# Altium schematic sheet EFM32PG22-40.SchDoc
size A4
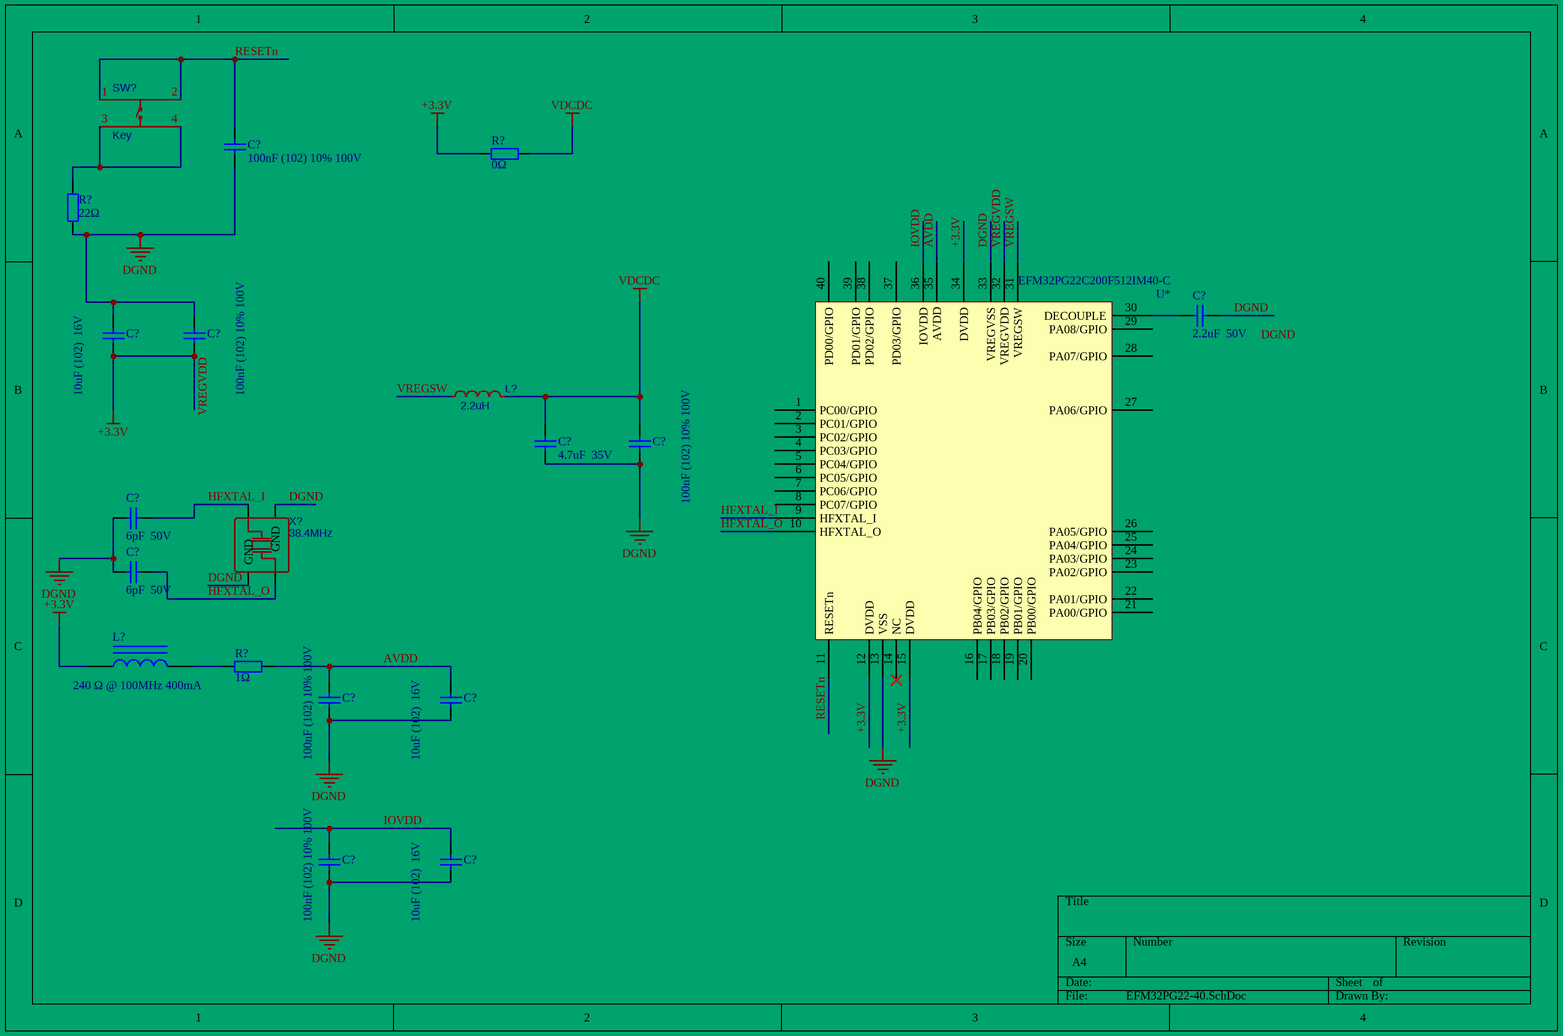
[diagram p0: EFM32PG22-40.SchDoc]

## Parts
(Parts that share a designator on the sheet are numbered #1, #2 ... from top to bottom, then left to right.)
C?#1  100nF (102) 10% 100V  [0805_C]
C?#2  2.2uF  50V  [0603_C]
C?#3  10uF (102)  16V  [0805_C]
C?#4  100nF (102) 10% 100V  [0805_C]
C?#5  4.7uF  35V  [0603_C]
C?#6  100nF (102) 10% 100V  [0805_C]
C?#7  6pF  50V  [0603_C]
C?#8  6pF  50V  [0603_C]
C?#9  100nF (102) 10% 100V  [0805_C]
C?#10  10uF (102)  16V  [0805_C]
C?#11  100nF (102) 10% 100V  [0805_C]
C?#12  10uF (102)  16V  [0805_C]
L?#1  2.2uH  [L1008]
L?#2  240 Ω @ 100MHz 400mA  [0603_L]
R?#1  0Ω  [0603_R]
R?#2  22Ω  [0603_R]
R?#3  1Ω  [0805_R]
SW?  Key  [SW-TH_4P-L6.0-W6.0-P4.50-LS6.5]
U*  EFM32PG22C200F512IM40-C  [QFN-40_L5.0-W5.0-P0.4-Hand]
X?  38.4MHz  [OSC-SMD_4P-L3.2-W2.5-BL]

## Nets
+3.3V: C?#3.1 C?#4.1 L?#2.1 R?#1.2 U*.12(DVDD) U*.15(DVDD) U*.32(VREGVDD) U*.34(DVDD)  [also labelled VREGVDD]
DGND: C?#1.1 C?#2.2 C?#3.2 C?#4.2 C?#5.1 C?#6.1 C?#7.1 C?#8.1 C?#9.1 C?#10.1 C?#11.1 C?#12.1 R?#2.1 U*.13(VSS) U*.33(VREGVSS) X?.2(GND) X?.4(GND)
VDCDC: C?#5.2 C?#6.2 L?#1.2 R?#1.1
AVDD: C?#9.2 C?#10.2 R?#3.2 U*.35(AVDD)
HFXTAL_I: C?#7.2 U*.9(HFXTAL_I) X?.3(OSC2)
HFXTAL_O: C?#8.2 U*.10(HFXTAL_O) X?.1(OSC1)
IOVDD: C?#11.2 C?#12.2 U*.36(IOVDD)
RESETn: C?#1.2 SW?.1(A) SW?.2(B) U*.11(RESETn)
VREGSW: L?#1.1 U*.31(VREGSW)
NetC?#2_1: C?#2.1 U*.30(DECOUPLE)
NetL?#2_2: L?#2.2 R?#3.1
NetR?#2_2: R?#2.2 SW?.3(C) SW?.4(D)

Not connected (* = marked no-connect by the designer): U* 1(PC00/GPIO) 2(PC01/GPIO) 3(PC02/GPIO) 4(PC03/GPIO) 5(PC04/GPIO) 6(PC05/GPIO) 7(PC06/GPIO) 8(PC07/GPIO) 14(NC)* 16(PB04/GPIO) 17(PB03/GPIO) 18(PB02/GPIO) 19(PB01/GPIO) 20(PB00/GPIO) 21(PA00/GPIO) 22(PA01/GPIO) 23(PA02/GPIO) 24(PA03/GPIO) 25(PA04/GPIO) 26(PA05/GPIO) 27(PA06/GPIO) 28(PA07/GPIO) 29(PA08/GPIO) 37(PD03/GPIO) 38(PD02/GPIO) 39(PD01/GPIO) 40(PD00/GPIO)

## Notes on the sheet
- Labels drawn without touching a wire or pin: DGND

## Library data of the parts
C?#1 C?#4 C?#6 C?#9 C?#11 = 0805 1nF (102) 10% 50V: TCC0805X7R104K101DTS; ComponentLink1Description: 供应商链接; ComponentLink1URL: http://www.szlcsc.com/product/details_52223.html; Package: 0805; Supplier: LC; SuppliersPartNumber: C51210
C?#2 = 0603 1.5pF (1R5) 0.25pF 50V: UMK107BBJ225KA-T; ComponentLink1Description: 供应商链接; ComponentLink1URL: http://www.szlcsc.com/product/details_1991.html; Package: 0603; Supplier: LC; SuppliersPartNumber: C1639
C?#3 C?#10 C?#12 = 0805 1nF (102) 10% 50V: EMK316BJ106ML-T; ComponentLink1Description: 供应商链接; ComponentLink1URL: http://www.szlcsc.com/product/details_52223.html; Package: 0805; Supplier: LC; SuppliersPartNumber: C51210
C?#5 C?#7 C?#8 = 0603 1.5pF (1R5) 0.25pF 50V: CL10C060DB8NNNC; ComponentLink1Description: 供应商链接; ComponentLink1URL: http://www.szlcsc.com/product/details_1991.html; Package: 0603; Supplier: LC; SuppliersPartNumber: C1639
L?#1 = 1008 2.2uH: LQM2HPN2R2MG0L; BOM_Manufacturer: MuRata; BOM_Manufacturer Part: LQM2HPN2R2MG0L
L?#2 = 0603 47nH: BK1608HS241-T; ComponentLink1Description: 供应商链接; ComponentLink1URL: http://www.szlcsc.com/product/details_30437.html; Package: 0603; Supplier: LC; SuppliersPartNumber: C29683
R?#1 = 0603 1KΩ (1001) 1%: ERJ3GEY0R00V
R?#2 = 0603 1KΩ (1001) 1%: RC0603FR-0722RL; ComponentLink1Description: 供应商链接; ComponentLink1URL: http://www.szlcsc.com/product/details_21904.html; Package: 0603; Supplier: LC; SuppliersPartNumber: C21190
R?#3 = 0805 0Ω (0R0) 1%: CRCW08051R00JNEA; ComponentLink1Description: 供应商链接; ComponentLink1URL: http://www.szlcsc.com/product/details_18165.html; Package: 0805; Supplier: LC; SuppliersPartNumber: C17477
SW? = Key: BOM_Manufacturer: SHOU HAN; BOM_Manufacturer Part: TS665CJ; Contributor: LCSC; BOM_Supplier: LCSC; BOM_Supplier Part: C393938; spicePre: S; spiceSymbolName: TS665CJ
U* = EFM32PG22C200F512IM40-C: BOM_Manufacturer: Silicon Laboratories; BOM_Manufacturer Part: EFM32PG22C200F512IM40-C
X? = 38.4MHz: X1E0000210660; BOM_Manufacturer: Seiko Epson; BOM_Manufacturer Part: X1E0000210660